# EAGLE design TMotor_Rev0_5_1_Mark_2_MAR17 (EAGLE 9.6.2)

## Sheet 1 of 5: Arduino Nano Sense and Teensy
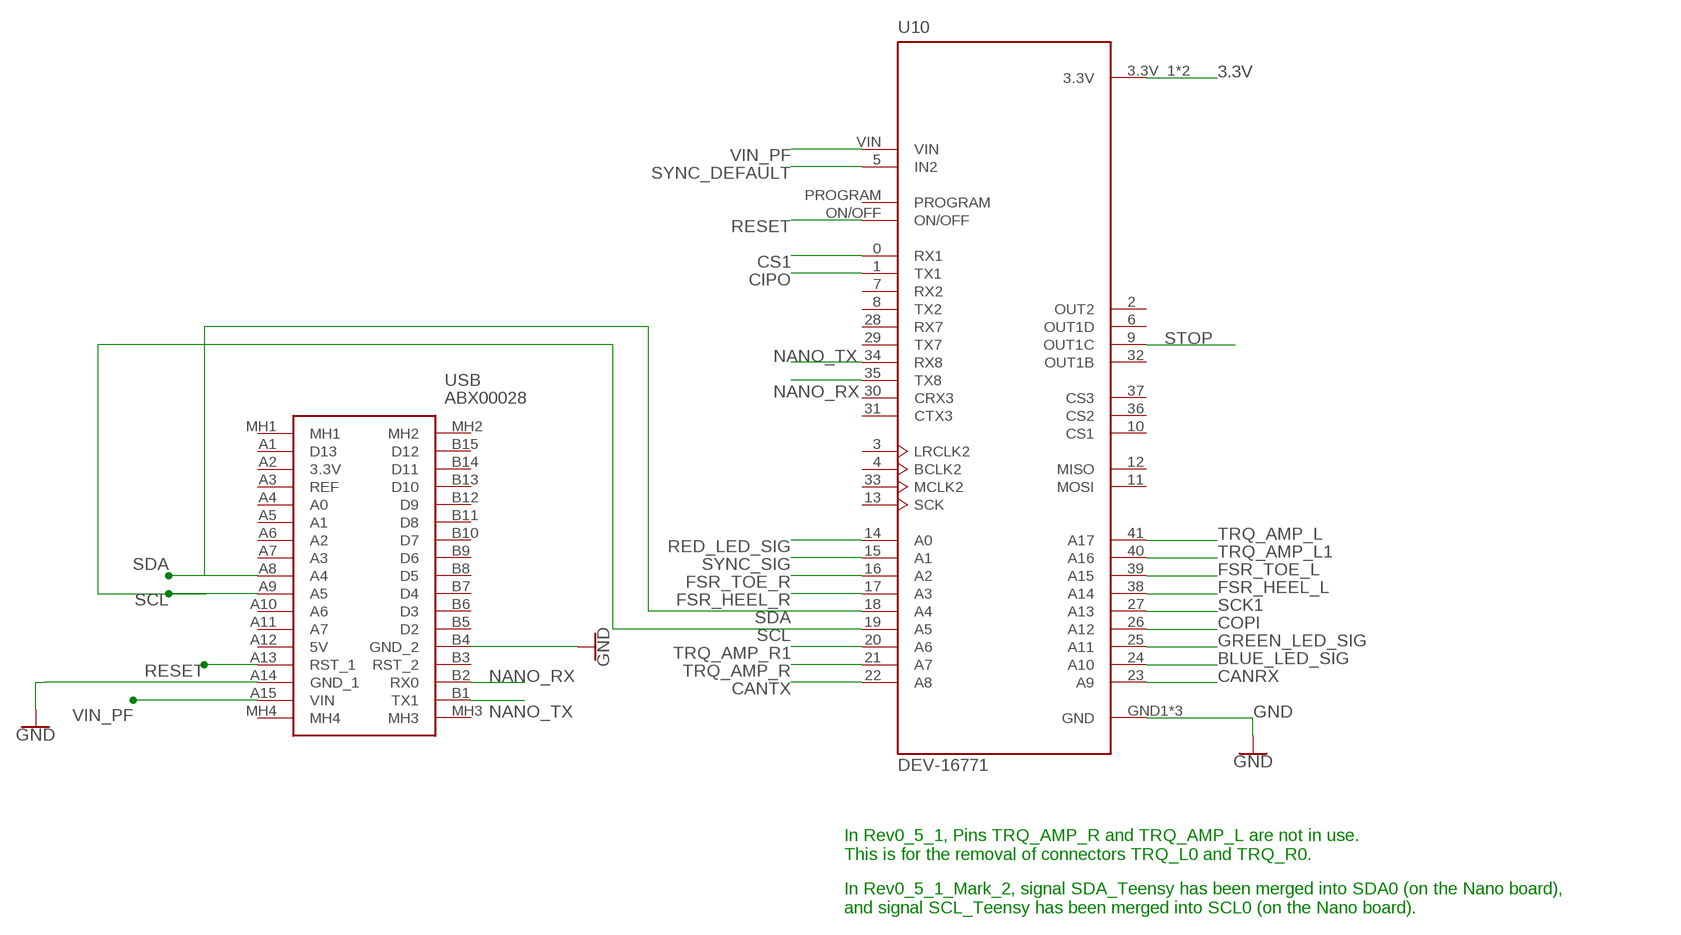
[diagram p0: schematic, sheet 1]

### Parts
U10  DEV-16771  [MODULE_DEV-16771]
USB  ABX00028  [ABX00028]

### Nets
3.3V: U10.3.3V_1(3.3V) U10.3.3V_2(3.3V) ; also sheet 2,4,5
BLUE_LED_SIG: U10.24(A10) ; also sheet 4
CANRX: U10.23(A9) ; also sheet 2
CANTX: U10.22(A8) ; also sheet 2
CIPO: U10.1(TX1) ; also sheet 2
COPI: U10.26(A12) ; also sheet 2
CS1: U10.0(RX1) ; also sheet 2
FSR_HEEL_L: U10.38(A14) ; also sheet 5
FSR_HEEL_R: U10.17(A3) ; also sheet 5
FSR_TOE_L: U10.39(A15) ; also sheet 5
FSR_TOE_R: U10.16(A2) ; also sheet 5
GND: U10.GND1(GND) U10.GND2(GND) U10.GND3(GND) USB.A14(GND_1) USB.B4(GND_2) ; also sheet 2,4,5
GREEN_LED_SIG: U10.25(A11) ; also sheet 4
NANO_RX: U10.35(TX8) USB.B2(RX0)
NANO_TX: U10.34(RX8) USB.B1(TX1)
RED_LED_SIG: U10.14(A0) ; also sheet 4
RESET: U10.ON/OFF USB.A13(RST_1) ; also sheet 2
SCK1: U10.27(A13) ; also sheet 2
SCL: U10.19(A5) USB.A9(A5) ; also sheet 2
SDA: U10.18(A4) USB.A8(A4) ; also sheet 2
STOP: U10.9(OUT1C) ; also sheet 2
SYNC_DEFAULT: U10.5(IN2) ; also sheet 2
SYNC_SIG: U10.15(A1) ; also sheet 4
TRQ_AMP_L: U10.41(A17)
TRQ_AMP_L1: U10.40(A16) ; also sheet 5
TRQ_AMP_R: U10.21(A7)
TRQ_AMP_R1: U10.20(A6) ; also sheet 5
VIN_PF: U10.VIN USB.A15(VIN) ; also sheet 2
Unconnected: U10.2(OUT2) U10.3(LRCLK2) U10.4(BCLK2) U10.6(OUT1D) U10.7(RX2) U10.8(TX2) U10.10(CS1) U10.11(MOSI) U10.12(MISO) U10.13(SCK) U10.28(RX7) U10.29(TX7) U10.30(CRX3) U10.31(CTX3) U10.32(OUT1B) U10.33(MCLK2) U10.36(CS2) U10.37(CS3) U10.PROGRAM USB.A1(D13) USB.A2(3.3V) USB.A3(REF) USB.A4(A0) USB.A5(A1) USB.A6(A2) USB.A7(A3) USB.A10(A6) USB.A11(A7) USB.A12(5V) USB.B3(RST_2) USB.B5(D2) USB.B6(D3) USB.B7(D4) USB.B8(D5) USB.B9(D6) USB.B10(D7) USB.B11(D8) USB.B12(D9) USB.B13(D10) USB.B14(D11) USB.B15(D12) USB.MH1 USB.MH2 USB.MH3 USB.MH4

### Notes on the sheet
- In Rev0_5_1, Pins TRQ_AMP_R and TRQ_AMP_L are not in use.
  This is for the removal of connectors TRQ_L0 and TRQ_R0.
- In Rev0_5_1_Mark_2, signal SDA_Teensy has been merged into SDA0 (on the Nano board),
  and signal SCL_Teensy has been merged into SCL0 (on the Nano board).

## Sheet 2 of 5: Motor Drivers & Power
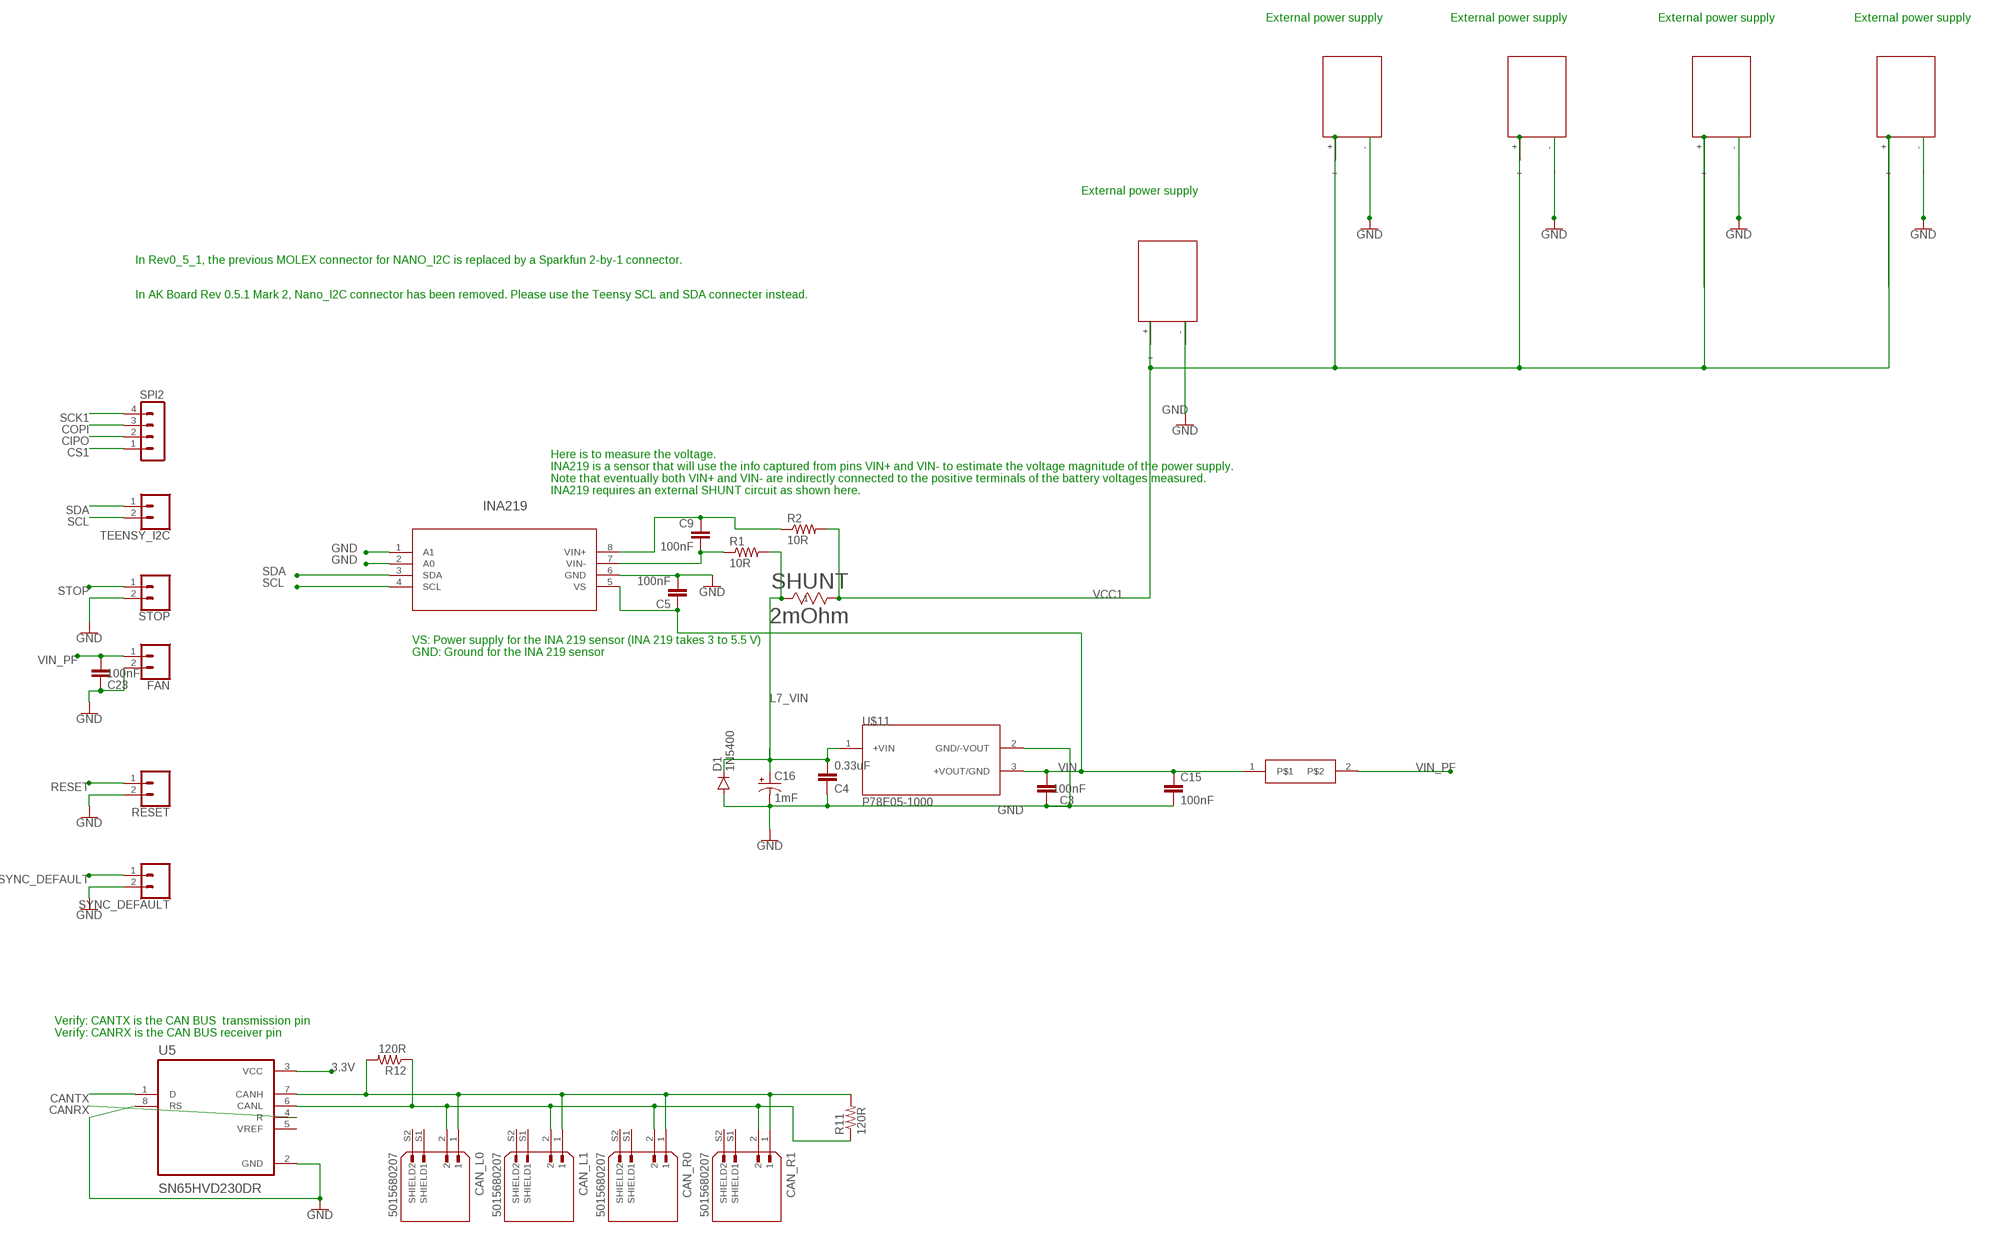
[diagram p1: schematic, sheet 2]

### Parts
C3  100nF  C-EU050-024X044  [C050-024X044]
C4  0.33uF  C-EU050-024X044  [C050-024X044]
C5  100nF  C-EU050-024X044  [C050-024X044]
C9  100nF  C-EU050-024X044  [C050-024X044]
C15  100nF  C-EU050-024X044  [C050-024X044]
C16  1mF  CPOL-USE5-10.5  [E5-10,5]
C23  100nF  C-EU050-024X044  [C050-024X044]
CAN_L0  5015680207  [MOLEX_5015680207]
CAN_L1  5015680207  [MOLEX_5015680207]
CAN_R0  5015680207  [MOLEX_5015680207]
CAN_R1  5015680207  [MOLEX_5015680207]
D1  1N5400  [DO201-15]
FAN  CONN_02  [1X02]
INA219  INA219AIDR  [D8_TEX]
R1  10R  R-US_0207/10  [0207/10]
R2  10R  R-US_0207/10  [0207/10]
R11  120R  R-US_0207/10  [0207/10]
R12  120R  R-US_0207/10  [0207/10]
RESET  CONN_02  [1X02]
SHUNT  2mOhm  CSNL2512FT2L00  [STA_CSNL2512(2)_STP]
SPI2  MA04-1  [MA04-1]
STOP  CONN_02  [1X02]
SYNC_DEFAULT  CONN_02  [1X02]
TEENSY_I2C  CONN_02  [1X02]
U5  SN65HVD230DR  [SOIC127P599X175-8N]
U$6  0458002.DR  [FUSE_LITTEL_448]
U$11  P78E05-1000  [P78E05-1000]
XT30UPB-F  L_0  XT30UPB-F  [XT30UPB-F]
XT30UPB-F1  L_0  XT30UPB-F  [XT30UPB-F]
XT30UPB-F2  L_0  XT30UPB-F  [XT30UPB-F]
XT30UPB-F3  L_0  XT30UPB-F  [XT30UPB-F]
XT30UPB-F4  L_0  XT30UPB-F  [XT30UPB-F]

### Nets
3.3V: U5.3(VCC) ; also sheet 1,4,5
CANRX: U5.4(R) ; also sheet 1
CANTX: U5.1(D) ; also sheet 1
CIPO: SPI2.2 ; also sheet 1
COPI: SPI2.3 ; also sheet 1
CS1: SPI2.1 ; also sheet 1
GND: C3.1 C4.1 C5.2 C15.2 C16.- C23.1 D1.A FAN.2 INA219.1(A1) INA219.2(A0) INA219.6(GND) RESET.2 STOP.2 SYNC_DEFAULT.2 U5.2(GND) U5.8(RS) U$11.2(GND/-VOUT) XT30UPB-F1.- XT30UPB-F2.- XT30UPB-F3.- XT30UPB-F4.- XT30UPB-F.- ; also sheet 1,4,5
L7_VIN: C4.2 C16.+ D1.C R1.2 SHUNT.1 U$11.1(+VIN)
N$23: C9.1 INA219.8(VIN+) R2.1
N$26: C9.2 INA219.7(VIN-) R1.1
N$44: CAN_L0.1 CAN_L1.1 CAN_R0.1 CAN_R1.1 R11.2 R12.2 U5.7(CANH)
N$45: CAN_L0.2 CAN_L1.2 CAN_R0.2 CAN_R1.2 R11.1 R12.1 U5.6(CANL)
RESET: RESET.1 ; also sheet 1
SCK1: SPI2.4 ; also sheet 1
SCL: INA219.4(SCL) TEENSY_I2C.2 ; also sheet 1
SDA: INA219.3(SDA) TEENSY_I2C.1 ; also sheet 1
STOP: STOP.1 ; also sheet 1
SYNC_DEFAULT: SYNC_DEFAULT.1 ; also sheet 1
VCC1: R2.2 SHUNT.2 XT30UPB-F1.+ XT30UPB-F2.+ XT30UPB-F3.+ XT30UPB-F4.+ XT30UPB-F.+
VIN: C3.2 C5.1 C15.1 INA219.5(VS) U$6.1 U$11.3(+VOUT/GND)
VIN_PF: C23.2 FAN.1 U$6.2 ; also sheet 1
Unconnected: CAN_L0.S1(SHIELD1) CAN_L0.S2(SHIELD2) CAN_L1.S1(SHIELD1) CAN_L1.S2(SHIELD2) CAN_R0.S1(SHIELD1) CAN_R0.S2(SHIELD2) CAN_R1.S1(SHIELD1) CAN_R1.S2(SHIELD2) U5.5(VREF)

### Notes on the sheet
- External power supply | External power supply | External power supply | External power supply
- External power supply
- In Rev0_5_1, the previous MOLEX connector for NANO_I2C is replaced by a Sparkfun 2-by-1 connector.
- In AK Board Rev 0.5.1 Mark 2, Nano_I2C connector has been removed. Please use the Teensy SCL and SDA connecter instead.
- Here is to measure the voltage.
  INA219 is a sensor that will use the info captured from pins VIN+ and VIN- to estimate the voltage magnitude of the power supply.
  Note that eventually both VIN+ and VIN- are indirectly connected to the positive terminals of the battery voltages measured.
  INA219 requires an external SHUNT circuit as shown here.
- VS: Power supply for the INA 219 sensor (INA 219 takes 3 to 5.5 V)
  GND: Ground for the INA 219 sensor
- Verify: CANTX is the CAN BUS  transmission pin
  Verify: CANRX is the CAN BUS receiver pin

## Sheet 3 of 5: FSRs filters
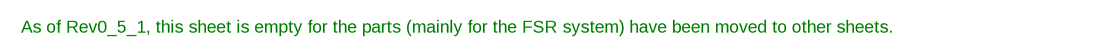
[diagram p2: schematic, sheet 3]

### Notes on the sheet
- As of Rev0_5_1, this sheet is empty for the parts (mainly for the FSR system) have been moved to other sheets.

## Sheet 4 of 5: LED
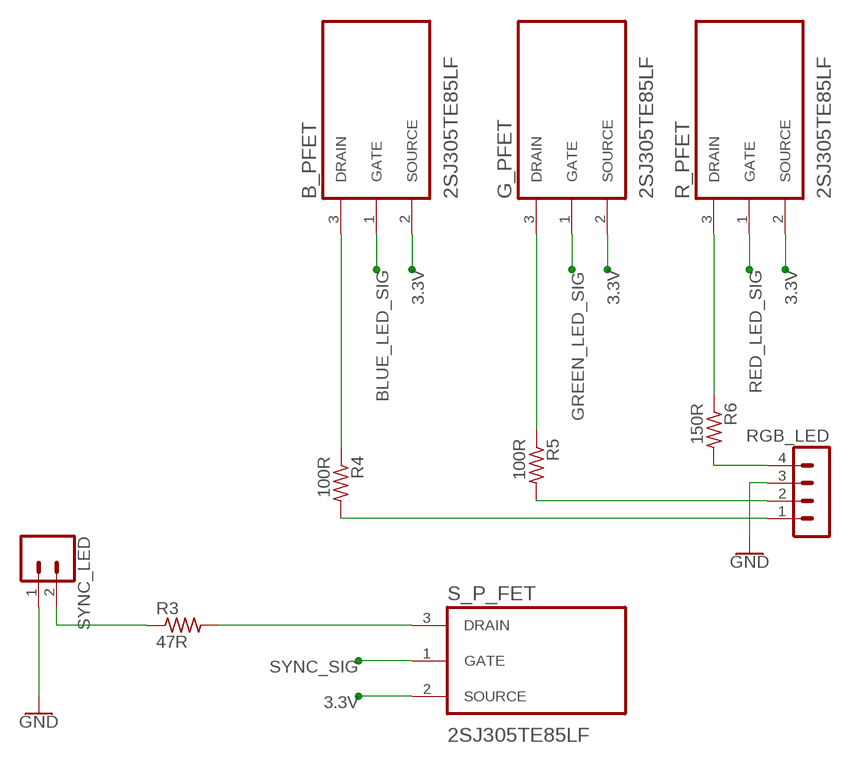
[diagram p3: schematic, sheet 4]

### Parts
B_PFET  2SJ305TE85LF  [TRANS_SSM3J325F,LF]
G_PFET  2SJ305TE85LF  [TRANS_SSM3J325F,LF]
R3  47R  R-US_0207/10  [0207/10]
R4  100R  R-US_0207/10  [0207/10]
R5  100R  R-US_0207/10  [0207/10]
R6  150R  R-US_0207/10  [0207/10]
R_PFET  2SJ305TE85LF  [TRANS_SSM3J325F,LF]
RGB_LED  MA04-1  [MA04-1]
S_P_FET  2SJ305TE85LF  [TRANS_SSM3J325F,LF]
SYNC_LED  CONN_02  [1X02]

### Nets
3.3V: B_PFET.2(SOURCE) G_PFET.2(SOURCE) R_PFET.2(SOURCE) S_P_FET.2(SOURCE) ; also sheet 1,2,5
BLUE_LED_SIG: B_PFET.1(GATE) ; also sheet 1
GND: RGB_LED.3 SYNC_LED.1 ; also sheet 1,2,5
GREEN_LED_SIG: G_PFET.1(GATE) ; also sheet 1
N$1: R4.2 RGB_LED.1
N$2: B_PFET.3(DRAIN) R4.1
N$17: R3.2 S_P_FET.3(DRAIN)
N$18: R3.1 SYNC_LED.2
N$24: R6.2 RGB_LED.4
N$25: R5.2 RGB_LED.2
N$30: G_PFET.3(DRAIN) R5.1
N$31: R6.1 R_PFET.3(DRAIN)
RED_LED_SIG: R_PFET.1(GATE) ; also sheet 1
SYNC_SIG: S_P_FET.1(GATE) ; also sheet 1

## Sheet 5 of 5: Bluetooth
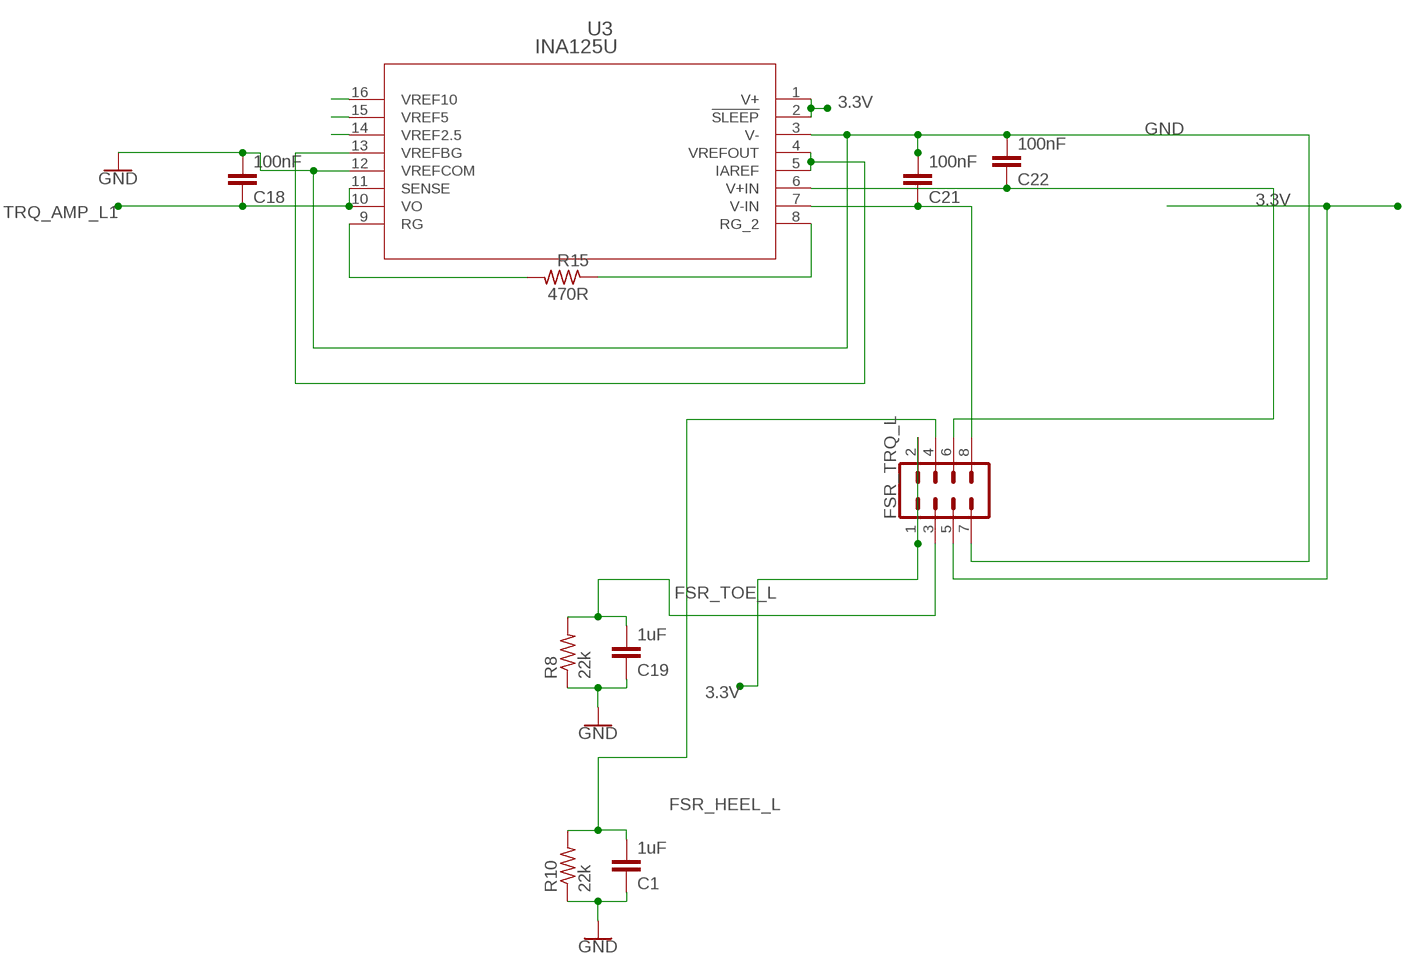
[diagram p4: schematic, sheet 5, part 1 of 2]
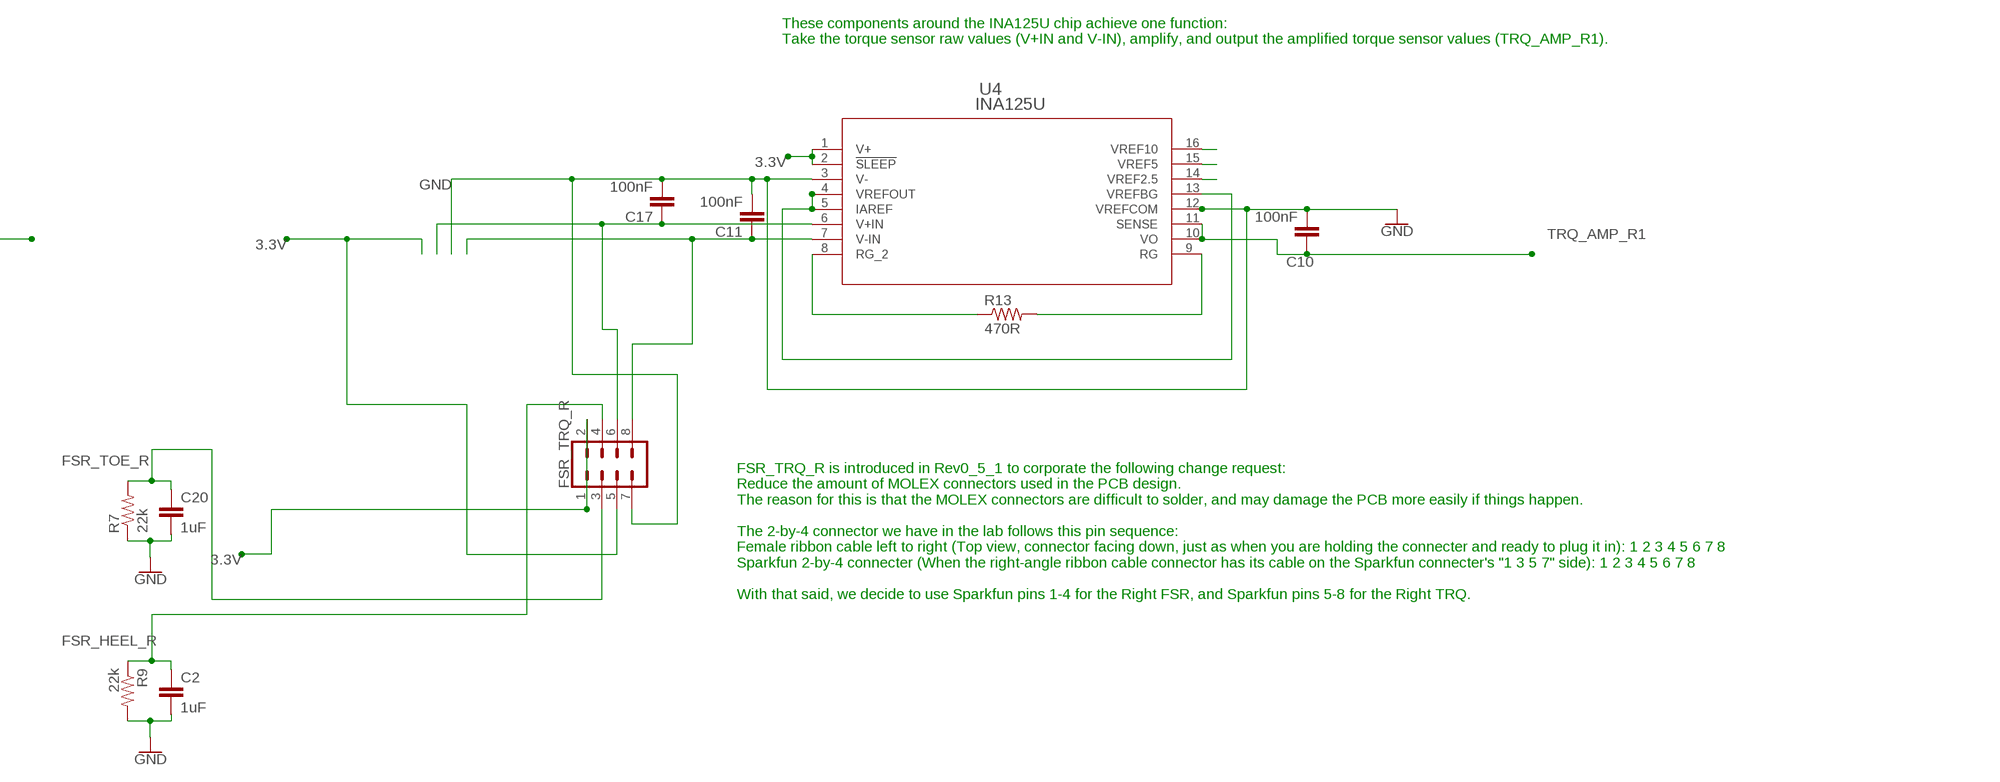
[diagram p5: schematic, sheet 5, part 2 of 2]

### Parts
C1  1uF  C-EU050-024X044  [C050-024X044]
C2  1uF  C-EU050-024X044  [C050-024X044]
C10  100nF  C-EU050-024X044  [C050-024X044]
C11  100nF  C-EU050-024X044  [C050-024X044]
C17  100nF  C-EU050-024X044  [C050-024X044]
C18  100nF  C-EU050-024X044  [C050-024X044]
C19  1uF  C-EU050-024X044  [C050-024X044]
C20  1uF  C-EU050-024X044  [C050-024X044]
C21  100nF  C-EU050-024X044  [C050-024X044]
C22  100nF  C-EU050-024X044  [C050-024X044]
FSR_TRQ_L  CONN_04X2  [2X4]
FSR_TRQ_R  CONN_04X2  [2X4]
R7  22k  R-US_0207/10  [0207/10]
R8  22k  R-US_0207/10  [0207/10]
R9  22k  R-US_0207/10  [0207/10]
R10  22k  R-US_0207/10  [0207/10]
R13  470R  R-US_0207/10  [0207/10]
R15  470R  R-US_0207/10  [0207/10]
U3  INA125U  [D16]
U4  INA125U  [D16]

### Nets
3.3V: FSR_TRQ_L.1 FSR_TRQ_L.2 FSR_TRQ_L.5 FSR_TRQ_R.1 FSR_TRQ_R.2 FSR_TRQ_R.5 U3.1(V+) U3.2(!SLEEP) U4.1(V+) U4.2(!SLEEP) ; also sheet 1,2,4
FSR_HEEL_L: C1.2 FSR_TRQ_L.4 R10.2 ; also sheet 1
FSR_HEEL_R: C2.1 FSR_TRQ_R.4 R9.1 ; also sheet 1
FSR_TOE_L: C19.2 FSR_TRQ_L.3 R8.2 ; also sheet 1
FSR_TOE_R: C20.1 FSR_TRQ_R.3 R7.2 ; also sheet 1
GND: C1.1 C2.2 C10.2 C11.2 C17.2 C18.2 C19.1 C20.2 C21.2 C22.2 FSR_TRQ_L.7 FSR_TRQ_R.7 R7.1 R8.1 R9.2 R10.1 U3.3(V-) U3.12(VREFCOM) U4.3(V-) U4.12(VREFCOM) ; also sheet 1,2,4
N$4: U4.16(VREF10)
N$14: U4.15(VREF5)
N$15: U4.4(VREFOUT) U4.5(IAREF) U4.13(VREFBG)
N$16: R13.1 U4.8(RG_2)
N$19: U4.14(VREF2.5)
N$27: R13.2 U4.9(RG)
N$28: C17.1 FSR_TRQ_R.6 U4.6(V+IN)
N$29: C11.1 FSR_TRQ_R.8 U4.7(V-IN)
N$32: U3.4(VREFOUT) U3.5(IAREF) U3.13(VREFBG)
N$33: C22.1 FSR_TRQ_L.6 U3.6(V+IN)
N$34: C21.1 FSR_TRQ_L.8 U3.7(V-IN)
N$35: R15.2 U3.9(RG)
N$36: R15.1 U3.8(RG_2)
N$40: U3.16(VREF10)
N$41: U3.15(VREF5)
N$42: U3.14(VREF2.5)
TRQ_AMP_L1: C18.1 U3.10(VO) U3.11(SENSE) ; also sheet 1
TRQ_AMP_R1: C10.1 U4.10(VO) U4.11(SENSE) ; also sheet 1

### Notes on the sheet
- These components around the INA125U chip achieve one function:
  Take the torque sensor raw values (V+IN and V-IN), amplify, and output the amplified torque sensor values (TRQ_AMP_R1).
- FSR_TRQ_R is introduced in Rev0_5_1 to corporate the following change request:
  Reduce the amount of MOLEX connectors used in the PCB design. 
  The reason for this is that the MOLEX connectors are difficult to solder, and may damage the PCB more easily if things happen.
  
  The 2-by-4 connector we have in the lab follows this pin sequence:
  Female ribbon cable left to right (Top view, connector facing down, just as when you are holding the connecter and ready to plug it in): 1 2 3 4 5 6 7 8
  Sparkfun 2-by-4 connecter (When the right-angle ribbon cable connector has its cable on the Sparkfun connecter's "1 3 5 7" side): 1 2 3 4 5 6 7 8
  
  With that said, we decide to use Sparkfun pins 1-4 for the Right FSR, and Sparkfun pins 5-8 for the Right TRQ.

## Library data of the parts
B_PFET G_PFET R_PFET S_P_FET = 2SJ305TE85LF:2SJ305TE85LF: None Check prices <https://pricing.snapeda.com/parts/2SJ305TE85LF/Toshiba/view-part?ref=eda>; AVAILABILITY: In Stock; DESCRIPTION: P-Channel 30V 200mA (Ta) 200mW (Ta) Surface Mount SC-59; MF: Toshiba; MP: 2SJ305TE85LF; PACKAGE: SC-59 Toshiba; PRICE: None; PURCHASE-URL: https://pricing.snapeda.com/search/part/2SJ305TE85LF/?ref=eda
C1-C5 C9-C11 C15 C17-C23 = rcl:C-EU: CAPACITOR, European symbol; SPICEPREFIX: C
C16 = rcl:CPOL-US: POLARIZED CAPACITOR, American symbol; SPICEPREFIX: C
CAN_L0 CAN_L1 CAN_R0 CAN_R1 = SnapEDA-Library:5015680207; MANUFACTURER: Molex; MAXIMUM_PACKAGE_HEIGHT: 3.2 mm; PARTREV: A; STANDARD: Manufacturer Recommendations
D1 = diode:1N5400: DIODE standard rectifier, 3 A, 50 V (Motorola)
FAN RESET STOP SYNC_DEFAULT SYNC_LED TEENSY_I2C = SparkFun-Connectors:CONN_02: Multi connection point. Often used as Generic Header-pin footprint for 0.1 inch spaced/style header connections On any of the 0.1 inch spaced packages, you can populate with these: Break Away Headers - Straight <https://www.sparkfun.com/products/116> (PRT-00116) Break Away Male Headers - Right Angle <https://www.sparkfun.com/products/553> (PRT-00553) Female Headers <https://www.sparkfun.com/products/115> (PRT-00115) Break Away Headers - Machine Pin <https://www.sparkfun.com/products/117> (PRT-00117) Break Away Female Headers - Swiss Machine Pin <https://www.sparkfun.com/products/743> (PRT-00743) For SCREWTERMINALS and SPRING TERMINALS visit here: Screw Terimnals on SparkFun.com <https://www.sparkfun.com/search/results?term=Screw+Terminals> (5mm/3.5mm/2.54mm spacing) This device is also useful as a general connection point to wire up your design to another part of your project. Our various solder wires solder well into these plated through hole pads. Hook-Up Wire - Assortment (Stranded, 22 AWG) <https://www.sparkfun.com/products/11375> (PRT-11375) Hook-Up Wire - Assortment (Solid Core, 22 AWG) <https://www.sparkfun.com/products/11367> (PRT-11367) View the entire wire category on our website here <https://www.sparkfun.com/categories/141> Special notes: Molex polarized connector foot print use with: PRT-08233 with associated crimp pins and housings. 2.54_SCREWTERM for use with PRT-10571. 3.5mm Screw Terminal footprints for PRT-08084 5mm Screw Terminal footprints for use with PRT-08432
FSR_TRQ_L FSR_TRQ_R = SparkFun-Connectors:CONN_04X2: Multi connection point. Often used as Generic Header-pin footprint for 0.1 inch spaced/style header connections On any of the 0.1 inch spaced packages, you can populate with these: Break Away Headers - Straight <https://www.sparkfun.com/products/116> (PRT-00116) Break Away Male Headers - Right Angle <https://www.sparkfun.com/products/553> (PRT-00553) Female Headers <https://www.sparkfun.com/products/115> (PRT-00115) Break Away Headers - Machine Pin <https://www.sparkfun.com/products/117> (PRT-00117) Break Away Female Headers - Swiss Machine Pin <https://www.sparkfun.com/products/743> (PRT-00743)
INA219 = INA219:INA219AIDR; BUILT_BY: EMA_UL_Team; MANUFACTURER_PART_NUMBER: INA219AIDR; SOURCELIBRARY: TI_2015-1-5; VENDOR: Texas Instruments
R1-R6 R11-R13 R15 = rcl:R-US_: RESISTOR, American symbol; SPICEPREFIX: R
R7-R10 = resistor:R-US_: RESISTOR, American symbol
RGB_LED SPI2 = con-lstb:MA04-1: PIN HEADER; OC_FARNELL: unknown; OC_NEWARK: unknown
SHUNT = ShuntResistor:CSNL2512FT2L00; BUILT_BY: EMA_UL_Team; MANUFACTURER_PART_NUMBER: CSNL2512FT2L00; SOURCELIBRARY: Stackpole_2014-12-31; VENDOR: Stackpole International
U3 U4 = Digikey:INA125U; DATASHEET_URL: http://www.ti.com/lit/gpn/INA125; DESCRIPTION: Instrumentation Amplifier with Precision Voltage Reference; FAMILY_NAME: SINGLE SUPPLY; GENERIC_PART_NUMBER: INA125; INDUSTRY_STD_PKG_TYPE: SOIC; MANUFACTURER: Texas Instruments; MANUFACTURER_PART_NUMBER: INA125U; PACKAGE_DESIGNATOR: D; PIN_COUNT: 16; VENDOR: Texas Instruments
U5 = SN65HVD230DR:SN65HVD230DR: Check availability <https://pricing.snapeda.com/parts/SN65HVD230DR/Texas%20Instruments/view-part?ref=eda>; AVAILABILITY: In Stock; DESCRIPTION: 3.3 V CAN Transceiver with Standby Mode; MF: Texas Instruments; MP: SN65HVD230DR; PACKAGE: SOIC-8 Texas Instruments; PRICE: None; PURCHASE-URL: https://pricing.snapeda.com/search/part/SN65HVD230DR/?ref=eda
U10 = SnapEDA-Library:DEV-16771: RT1062 Teensy 4.1 i.MX ARM Cortex-M7 MPU Embedded Evaluation Board; MANUFACTURER: SparkFun Electronics; MAXIMUM_PACKAGE_HEIGHT: 4.07mm; PARTREV: 4.1; STANDARD: Manufacturer recommendations
U$6 = SnapEDA-Library (1):0458002.DR: 0448002.MR Digi-Key Part Number - F1638TR-ND - Tape & Reel (TR) - F1638CT-ND - Cut Tape (CT) - F1638DKR-ND - Digi-Reel® Manufacturer - Littelfuse Inc. Manufacturer Product Number - 0448002.MR Description - FUSE BOARD MNT 2A 125VAC/VDC SMD
U$11 = SnapEDA-Library_Paul:P78E05-1000: Digikey 102-5018-ND Non-Isolated PoL Module DC DC Converter 1 Output 5V 1A 8V - 36V Input
USB = ABX00028:ABX00028: Development Boards & Kits - AVR Arduino Nano Every Source: Datasheet <https://store.arduino.cc/arduino-nano-every>; ARROW_PART_NUMBER: ABX00028; ARROW_PRICE-STOCK: https://www.arrow.com/en/products/abx00028/arduino-corporation; DESCRIPTION: Development Boards & Kits - AVR Arduino Nano Every; HEIGHT: 10mm; MANUFACTURER_NAME: Arduino; MANUFACTURER_PART_NUMBER: ABX00028; MOUSER_PART_NUMBER: 782-ABX00028; MOUSER_PRICE-STOCK: https://www.mouser.co.uk/ProductDetail/Arduino/ABX00028/?qs=PzGy0jfpSMtit6rnFl8mVg%3D%3D
XT30UPB-F XT30UPB-F1-XT30UPB-F4 = XT30UPB-F:XT30UPB-F: XT30 PCB Mount Upright Female Power Connector. 15A cont. 30A burst.

## Board
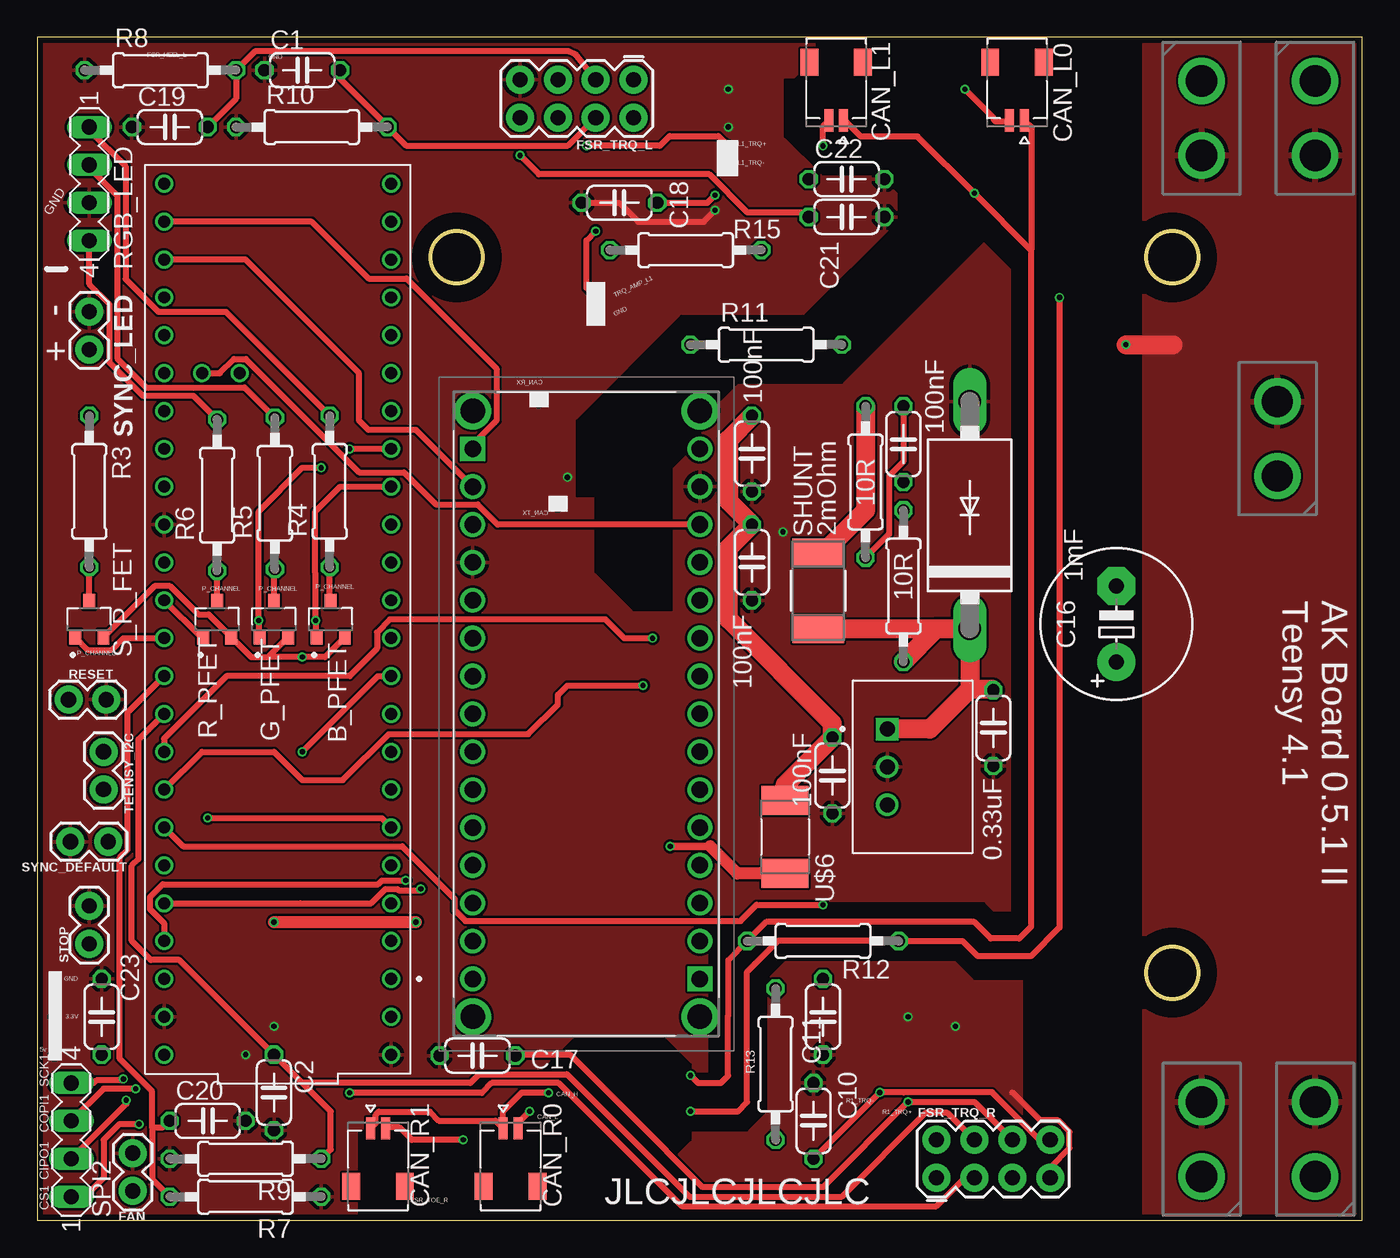
[diagram p6: board, top side]
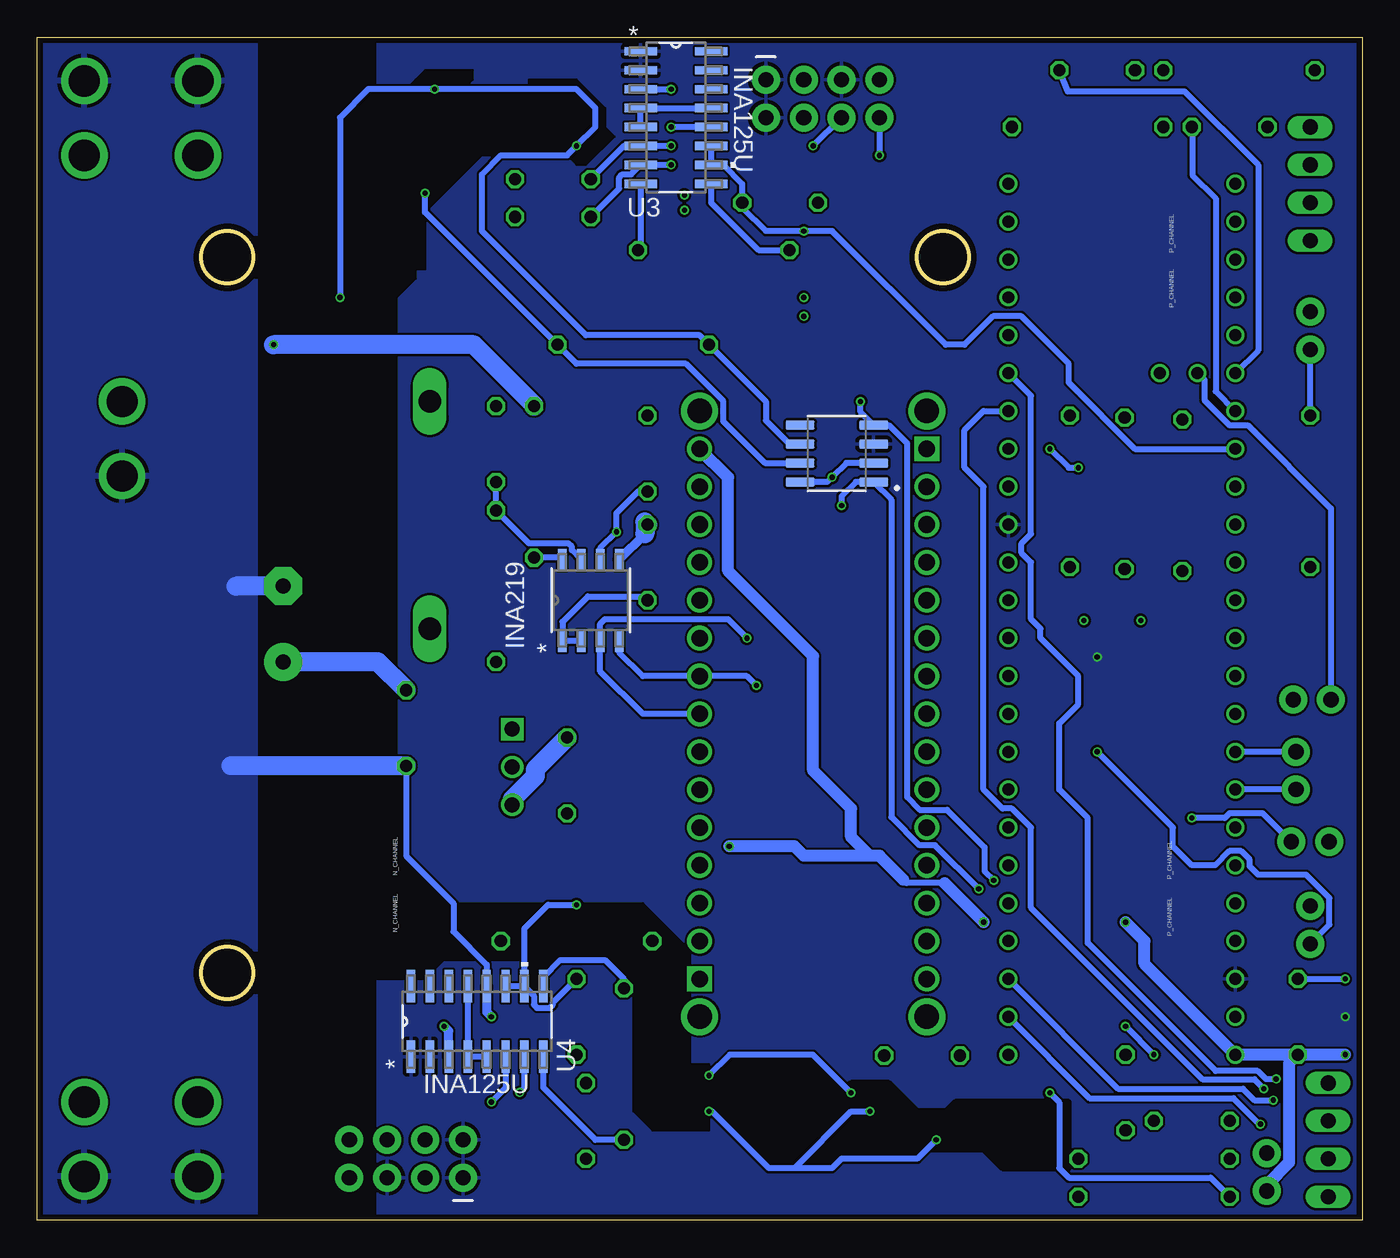
[diagram p7: board, bottom side, seen from below]

Size 88.88 x 79.36 mm. Coordinates in mm from the lower left corner, seen from the top.
Outline: 0,0 88.88,0 88.88,79.36 0,79.36 0,0
Outline: circle at 28.13,64.6 radius 1.75
Outline: circle at 76.13,64.6 radius 1.75
Outline: circle at 76.13,16.6 radius 1.75
Copper layers (1*16): Top 0.035559375mm / dielectric 1.6mm / Bottom 0.035559375mm
Design rules "oshpark-2layer": minimum track width 6mil, minimum drill 10mil, track to track 6mil, track to pad 6mil, pad to pad 6mil, via to via 6mil, smd to smd 6mil, copper to edge 15mil, drill to drill 6mil, minimum pad ring 5mil, minimum via ring 5mil, stop-mask expansion 2.5mil, vias tented up to drill 0mil, thermal gap 10mil
tRestrict: area 56.8,18.1 to 58.2,18.1; area 73.1,61.6 to 79.1,67.6; area 73.1,13.6 to 79.1,19.6; area 25.1,61.6 to 31.1,67.6; area 27.3,2.2 to 43.8,12.4; area 36.2,6 to 69.8,76.5; area 50.2,60.6 to 70.5,77.2; area 37.5,41 to 42.5,50.5
bRestrict: area 19.7,3.5 to 34.9,9.2; area 50.2,63.8 to 66,76.5; area 59.7,72.7 to 65.4,77.2; area 43.8,6 to 69.8,76.5
vRestrict: area 47,12.4 to 69.2,79.1

### Footprints (pad centres in the part's own frame; a part is rotated, then mirrored left to right if it is on the bottom)
TRANS_SSM3J325F,LF = smd 1 x 0.8: 1 -1.2,0.95; 2 -1.2,-0.95; 3 1.2,0
C050-024X044 = drill 0.813 octagon: 1 -2.54,0; 2 2.54,0
E5-10,5 = drill 1.016 pad 2.54: + -2.54,0 | drill 1.016 pad 2.54 octagon: - 2.54,0
MOLEX_5015680207 = smd 0.6 x 1.5: 1 -0.5,2.55; 2 0.5,2.55 | smd 1.2 x 1.8: S1 1.8,-1.35; S2 -1.8,-1.35
DO201-15 = drill 1.499 long: A 7.62,0; C -7.62,0
1X02 = drill 1.016 pad 1.88: 1 0,0; 2 2.54,0
2X4 = drill 1.016 pad 1.88: 1 -3.81,-1.27; 2 -3.81,1.27; 3 -1.27,-1.27; 4 -1.27,1.27; 5 1.27,-1.27; 6 1.27,1.27; 7 3.81,-1.27; 8 3.81,1.27
D8_TEX = smd 1.46 x 0.559: 1 -2.724,1.905; 2 -2.724,0.635; 3 -2.724,-0.635; 4 -2.724,-1.905; 5 2.724,-1.905; 6 2.724,-0.635; 7 2.724,0.635; 8 2.724,1.905
0207/10 = drill 0.813 octagon: 1 -5.08,0; 2 5.08,0
MA04-1 = drill 1.016 long: 1 -3.81,0; 2 -1.27,0; 3 1.27,0; 4 3.81,0
STA_CSNL2512(2)_STP = smd 1.88 x 3.429: 1 -2.565,0; 2 2.565,0
D16 = smd 2.184 x 0.559: 1 -2.362,4.445; 2 -2.362,3.175; 3 -2.362,1.905; 4 -2.362,0.635; 5 -2.362,-0.635; 6 -2.362,-1.905; 7 -2.362,-3.175; 8 -2.362,-4.445; 9 2.362,-4.445; 10 2.362,-3.175; 11 2.362,-1.905; 12 2.362,-0.635; 13 2.362,0.635; 14 2.362,1.905; 15 2.362,3.175; 16 2.362,4.445
SOIC127P599X175-8N = smd 1.97 x 0.6: 1 -2.47,1.905; 2 -2.47,0.635; 3 -2.47,-0.635; 4 -2.47,-1.905; 5 2.47,-1.905; 6 2.47,-0.635; 7 2.47,0.635; 8 2.47,1.905
MODULE_DEV-16771 = drill 0.8: 0 -26.67,-7.62; 1 -24.13,-7.62; 2 -21.59,-7.62; 3 -19.05,-7.62; 3.3V_1 6.35,-7.62; 3.3V_2 -24.13,7.62; 4 -16.51,-7.62; 5 -13.97,-7.62; 6 -11.43,-7.62; 7 -8.89,-7.62; 8 -6.35,-7.62; 9 -3.81,-7.62; 10 -1.27,-7.62; 11 1.27,-7.62; 12 3.81,-7.62; 13 3.81,7.62; 14 1.27,7.62; 15 -1.27,7.62; 16 -3.81,7.62; 17 -6.35,7.62; 18 -8.89,7.62; 19 -11.43,7.62; 20 -13.97,7.62; 21 -16.51,7.62; 22 -19.05,7.62; 23 -21.59,7.62; 24 8.89,-7.62; 25 11.43,-7.62; 26 13.97,-7.62; 27 16.51,-7.62; 28 19.05,-7.62; 29 21.59,-7.62; 30 24.13,-7.62; 31 26.67,-7.62; 32 29.21,-7.62; 33 29.21,7.62; 34 26.67,7.62; 35 24.13,7.62; 36 21.59,7.62; 37 19.05,7.62; 38 16.51,7.62; 39 13.97,7.62; 40 11.43,7.62; 41 8.89,7.62; GND1 -29.21,-7.62; GND2 6.35,7.62; GND3 -26.67,7.62; ON/OFF 16.51,5.08; PROGRAM 16.51,2.54; VIN -29.21,7.62
FUSE_LITTEL_448 = smd 1.956 x 3.15: 1 -2.451,0; 2 2.451,0
P78E05-1000 = drill 1 square: 1 -2.54,-2.54 | drill 1: 2 0,-2.54; 3 2.54,-2.54
ABX00028 = drill 1.11 pad 1.665 square: A1 0,0; B1 35.56,15.24 | drill 1.11 pad 1.665: A2 2.54,0; A3 5.08,0; A4 7.62,0; A5 10.16,0; A6 12.7,0; A7 15.24,0; A8 17.78,0; A9 20.32,0; A10 22.86,0; A11 25.4,0; A12 27.94,0; A13 30.48,0; A14 33.02,0; A15 35.56,0; B2 33.02,15.24; B3 30.48,15.24; B4 27.94,15.24; B5 25.4,15.24; B6 22.86,15.24; B7 20.32,15.24; B8 17.78,15.24; B9 15.24,15.24; B10 12.7,15.24; B11 10.16,15.24; B12 7.62,15.24; B13 5.08,15.24; B14 2.54,15.24; B15 0,15.24 | drill 1.65 pad 2.475: MH1 -2.54,0; MH2 -2.54,15.24; MH3 38.1,15.24; MH4 38.1,0
XT30UPB-F = drill 2.1: + 0,0; - 5,0

### Placement (x,y rotation side)
B_PFET  19.69,40.33 90 top
C1  17.78,77.16 0 top
C2  15.88,8.58 270 top
C3  47.94,44.14 90 top
C4  64.14,33.02 90 top
C5  53.34,29.85 270 top
C9  58.1,52.07 270 top
C10  52.7,13.65 270 top
C11  52.07,6.67 90 top
C15  47.94,51.44 270 top
C16  72.39,40.01 90 top
C17  29.53,11.05 180 top
C18  39.05,68.27 180 top
C19  8.89,73.34 0 top
C20  11.43,6.67 0 top
C21  54.29,67.31 0 top
C22  54.29,69.85 0 top
C23  4.32,13.65 270 top
CAN_L0  65.72,76.33 180 top
CAN_L1  53.59,76.33 180 top
CAN_R0  31.75,3.63 0 top
CAN_R1  22.86,3.63 0 top
D1  62.55,47.31 90 top
FAN  6.41,1.97 90 top
FSR_TRQ_L  36.2,75.25 180 top
FSR_TRQ_R  64.14,4.13 0 top
G_PFET  15.88,40.33 90 top
INA219  51.75,41.59 90 bottom
R1  58.1,42.55 270 top
R2  55.56,49.53 90 top
R3  3.49,48.9 270 top
R4  19.62,48.9 90 top
R5  15.94,48.77 90 top
R6  12.07,48.64 90 top
R7  13.97,1.59 180 top
R8  8.26,77.16 0 top
R9  13.97,4.13 180 top
R10  18.41,73.34 0 top
R11  48.9,58.74 0 top
R12  52.7,18.73 180 top
R13  49.53,10.48 90 top
R15  43.5,65.09 180 top
R_PFET  12.07,40.33 90 top
RESET  2.1,34.93 0 top
RGB_LED  3.49,69.53 270 top
S_P_FET  3.49,40.33 90 top
SHUNT  52.39,42.23 90 top
SPI2  2.29,5.4 90 top
STOP  3.49,18.54 90 top
SYNC_DEFAULT  4.76,25.4 180 top
SYNC_LED  3.49,60.96 270 top
TEENSY_I2C  4.45,31.44 270 top
U3  46.04,73.98 0 bottom
U4  59.37,13.34 90 bottom
U5  35.24,51.44 180 bottom
U10  16.13,40.33 90 top
U$6  50.17,25.72 270 top
U$11  59.56,30.42 270 top
USB  44.45,16.2 90 top
XT30UPB-F  78.11,71.44 90 top
XT30UPB-F1  85.72,71.44 90 top
XT30UPB-F2  78.11,7.94 270 top
XT30UPB-F3  85.72,7.94 270 top
XT30UPB-F4  83.19,54.93 270 top

### Tracks (layer width: path | path; a pad name or v marks a point on that pad's centre or on a via)
3.3V  (via drill 0.35)
  Top 0.406: S_P_FET.2 7.87,42.55 8.91,42.55 10.81,40.64 11.5,40.64 R_PFET.2 14.36,37.79 15.48,37.79 | 15.48,37.79 G_PFET.2 | B_PFET.2 19.3,37.79 v17.78,37.79 15.48,37.79
  other vias: 1.14,13.65
  pour Bottom: -1.27,80.65 66.04,80.65 66.04,-1.65 -1.27,-1.65
BLUE_LED_SIG  (via drill 0.35)
  Top 0.406: B_PFET.1 18.67,39.19 v18.67,40.24 18.67,43.41 18.66,43.42 18.66,47.55 20.32,49.22 U10.24
CANRX  (via drill 0.35)
  Top 0.406: U10.23 8.51,19.92 7.55,20.88 7.55,21.67 8.43,22.55 22.88,22.55 23.12,22.79 24.71,22.79 v24.72,22.8
  Bottom 0.406: v24.72,22.8 25.34,23.42 25.34,25.02 27.86,27.54 29.69,27.54 30.53,28.38 30.53,52.12 31.75,53.34 U5.4 33.66,54.23 v33.66,54.93
CANTX  (via drill 0.35)
  Top 0.406: U10.22 17.65,21.27 22.4,21.27 23.35,22.23 24.15,22.23 24.23,22.14 25.63,22.14 v25.73,22.24
  Bottom 0.406: v25.73,22.24 28.66,25.17 29.7,25.17 31.59,27.06 31.59,48.35 U5.1 33.97,49.53 34.93,48.58 v34.93,47.95
CIPO  (via drill 0.35)
  Top 0.406: v5.97,8.07 5.97,7.81 SPI2.2
  Bottom 0.406: U10.1 16.38,8.83 8,8.83 7.24,8.07 v5.97,8.07
COPI  (via drill 0.35)
  Top 0.406: v6.6,8.83 4.44,8.83 SPI2.3
  Bottom 0.406: v6.6,8.83 7.24,9.46 10.72,9.46 22.23,20.97 22.23,26.35 23.5,27.62 24.13,27.62 25.4,28.9 25.4,49.22 26.67,50.48 26.67,53.02 25.4,54.3 U10.26
CS1  (via drill 0.35)
  Top 0.406: v6.82,6.45 5.5,6.45 4.45,5.4 4.45,2.86 3.18,1.59 SPI2.1
  Bottom 0.406: v6.82,6.45 6.86,6.42 8.64,8.19 18.29,8.19 U10.0
FSR_HEEL_L
  Top 0.152: 20.16,76.74 C1.2
  Top 0.406: 20.16,76.74 23.16,73.74 R10.2 24.73,72.1 35.59,72.1 FSR_TRQ_L.4
  Bottom 0.406: U10.38 6.98,58.36 6.98,70.8 11.92,75.74 19.76,75.74 C1.2
FSR_HEEL_R
  Top 0.406: U10.17 6.8,32.26 6.8,24.24 6.35,23.8 6.35,18.73 7.62,17.47 9.53,17.47 C2.1 17.78,9.21 | FSR_TRQ_R.4 61.06,7.2 59.59,7.2 53.98,1.59 43.74,1.59 35.52,9.81 35.48,9.77 29.61,9.77 29.05,9.21 17.78,9.21 | R9.1 19.69,4.77 19.69,7.3 17.78,9.21
FSR_TOE_L
  Top 0.406: FSR_TRQ_L.3 36.1,78.22 35.66,78.42 14.61,78.42 R8.2 13.34,75.25 C19.2
  Bottom 0.152: C19.2 11.39,73.3
  Bottom 0.406: U10.39 9.83,55.62 9.83,68.57 11.39,70.12 11.39,73.3
FSR_TOE_R  (via drill 0.35)
  Top 0.406: U10.16 6.06,34.06 6.06,24.87 5.54,24.34 5.54,10.82 7.71,8.65 7.71,6.24 | 7.71,6.24 7.71,2.77 R7.2 | 7.71,6.24 8.4,6.24 C20.1 | FSR_TRQ_R.3 62.23,2.86 60.33,0.96 43.24,0.96 34.98,9.21 30.48,9.21 29.82,8.55 v20.96,8.55
  Bottom 0.406: R7.2 10.16,2.86 19.69,2.86 20.32,3.5 20.32,7.92 v20.96,8.55
GND  (via drill 0.35)
  Top 0.406: C18.2 39.05,68.27 40.32,66.99 44.7,66.99 v45.47,67.76 | FSR_TRQ_R.7 67.94,3.57 69.24,4.86 69.24,5.94 68.48,6.7 67.28,6.7 65.41,8.58
  Bottom 0.406: INA219.2 INA219.1 53.66,40.14 51.94,41.86 48.21,41.86 C3.1 | INA219.6 51.12,45.1 v50.03,46.19 50.03,47.45 48.58,48.9 C15.2 | C23.1 v1.14,16.2 | C4.1 64.14,24.45 60.96,21.27 60.96,19.37 58.74,17.15 U4.12 | U5.2 34.61,50.8 v35.56,49.85 35.88,49.53 U5.8 | U3.12 v46.36,73.34 | U3.3 v46.36,75.88 | v13.97,11.12 15.85,13 15.85,13.02
  Bottom 0.61: U4.12 58.74,13.97 v58.42,13.65 | U4.3 61.28,12.7 v61.59,13.02
  Bottom 1.27: C16.- 75.56,42.55 | C4.1 75.88,30.48
  other vias: 37.47,60.65 15.88,13.02
  pour Top: -0.7,80.01 66.04,80.01 66.04,-1.01 -0.7,-1.01
  pour Bottom: 74.3,79.69 74.3,-0.95 90.81,-0.95 90.81,79.69
GREEN_LED_SIG  (via drill 0.35)
  Top 0.406: G_PFET.1 14.86,39.19 v14.86,40.24 14.86,47.56 17.78,50.48 v19.05,50.48 | U10.25 v20.96,51.76
  Bottom 0.406: v20.96,51.76 19.69,50.48 v19.05,50.48
L7_VIN
  Top 1.27: D1.C 62.52,39.66 SHUNT.1 | 62.55,35.64 64.06,35.64 C4.2 | D1.C 62.55,35.64 | 62.55,35.64 59.87,32.96 U$11.1 | R1.2 60.33,39.69 D1.C
  Bottom 1.27: C4.2 66.04,37.47 C16.+
N$1
  Top 0.406: RGB_LED.1 3.49,73.15 5.93,70.71 5.93,63.14 8.11,60.96 12.64,60.96 R4.2
N$2
  Top 0.406: B_PFET.3 19.62,41.59 R4.1
N$15
  Bottom 0.406: U4.5 U4.4 U4.13
N$16
  Bottom 0.406: R13.1 51.44,5.4 54.93,8.89 U4.8
N$17
  Top 0.406: S_P_FET.3 R3.2
N$18
  Bottom 0.406: R3.1 3.49,58.37 SYNC_LED.2
N$23
  Top 0.406: C9.1 58.1,50.9 57.14,49.93 57.14,46.03 R2.1
  Bottom 0.406: INA219.8 53.79,44.45 R2.1
N$24
  Top 0.406: RGB_LED.4 3.49,62.81 4.81,61.49 4.81,57.58 7.07,55.32 10.47,55.32 R6.2
N$25
  Top 0.406: RGB_LED.2 3.49,70.61 5.37,68.73 5.37,57.81 7.31,55.88 13.91,55.88 R5.2
N$26
  Bottom 0.406: C9.2 R1.1 55.89,45.42 53.24,45.42 53.02,45.2 53.02,44.95 INA219.7
N$27
  Bottom 0.406: U4.9 54.93,16.34 53.8,17.47 50.8,17.47 49.53,16.2 R13.2
N$28  (via drill 0.35)
  Top 0.406: C17.1 32.1,11.09 35.77,11.09 39.78,7.08 44.64,2.23 52.7,2.23 v58.42,7.94 62.87,7.94 FSR_TRQ_R.6
  Bottom 0.406: U4.6 57.47,8.89 v58.42,7.94
N$29  (via drill 0.35)
  Top 0.406: FSR_TRQ_R.8 67.24,5.4 64.04,8.6 58.15,8.6 58.12,8.58 v56.52,8.58 C11.1
  Bottom 0.406: v56.52,8.58 56.2,8.89 U4.7
N$30
  Top 0.406: G_PFET.3 15.88,43.63 R5.1
N$31
  Top 0.406: R_PFET.3 R6.1
N$32
  Bottom 0.406: U3.5 U3.4 48.4,74.59 44.18,74.59 44.16,74.61 U3.13
N$33  (via drill 0.35)
  Top 0.406: v36.83,72.07 41.76,72.07 42.42,72.74 45.69,72.74 v46.36,72.07
  Bottom 0.406: v36.83,72.07 FSR_TRQ_L.6 | C22.1 49.53,72.07 U3.6 v46.36,72.07
N$34  (via drill 0.35)
  Top 0.406: v32.38,71.44 33.66,70.17 45.09,70.17 47.62,67.63 51.44,67.63 C21.1
  Bottom 0.406: FSR_TRQ_L.8 v32.38,71.44 | C21.1 49.85,69.22 49.85,69.96 49.64,70.17 49.04,70.17 U3.7 v46.36,70.8
N$35
  Bottom 0.406: U3.9 43.67,68.27 40.5,65.09 R15.2
N$36
  Bottom 0.406: U3.8 48.4,65.27 R15.1
N$44  (via drill 0.35)
  Top 0.406: v43.81,9.72 44.32,9.21 45.86,9.21 46.34,9.7 46.34,13.74 46.36,13.75 46.36,17.47 R12.2 48.9,20.01 62.87,20.01 63.97,18.91 65.87,18.91 66.67,19.7 66.67,65.1 | CAN_R1.1 22.7,6.52 22.7,7.07 22.91,7.28 26.35,7.28 26.94,6.69 30.73,6.69 CAN_R0.1 31.25,7.3 32.52,8.58 34.29,8.58 v34.29,8.55 | 54,73.68 CAN_L1.1 54.17,73.78 55.25,72.71 59.05,72.71 v62.87,68.9 66.67,65.1 | CAN_L0.1 66.68,73.33 66.68,65.11 66.67,65.1
  Bottom 0.406: v43.81,9.72 42.42,11.12 36.85,11.12 v34.29,8.55 | U5.7 40.07,50.8 42.86,53.59 42.86,54.96 45.37,57.47 52.7,57.47 R11.2 62.87,67.63 v62.87,68.9
N$45  (via drill 0.35)
  Top 0.406: v43.81,7.3 46.99,7.3 47.62,7.94 47.62,16.68 49.68,18.73 R12.1 62.08,18.73 63.1,17.71 66.64,17.71 68.58,19.65 v68.58,61.91 | v33.02,7.3 32.25,6.54 CAN_R0.2 | CAN_L0.2 65.06,73.78 65,73.72 64.29,73.72 64.16,73.84 64.16,73.95 v62.23,75.88 | CAN_R1.2 23.52,6.18 23.58,6.23 24.3,6.23 25.13,5.4 v28.58,5.4 | v52.7,72.07 52.7,73.39 CAN_L1.2
  Bottom 0.406: 38.1,3.5 35.56,3.5 34.93,4.13 29.85,4.13 v28.58,5.4 | 38.1,3.5 39.8,3.5 43.61,7.3 v43.81,7.3 | 37.78,52 U5.6 38.42,52.07 40.01,53.66 40.01,54.93 R11.1 44.45,59.38 52.07,59.38 59.05,66.36 59.05,70.17 57.78,71.44 53.34,71.44 v52.7,72.07 51.44,73.34 51.44,74.61 52.7,75.88 v62.23,75.88 66.68,75.88 68.58,73.98 v68.58,61.91 | 38.1,3.5 34.29,7.3 v33.02,7.3
NANO_RX
  Top 0.406: USB.B2 25.4,53.02 22.23,53.02 21.59,53.66 21.59,56.84 13.97,64.45 U10.35
NANO_TX
  Top 0.406: U10.34 18.41,66.99 22.23,63.18 24.77,63.18 30.8,57.15 30.8,53.64 29.21,52.04 USB.B1
RED_LED_SIG
  Top 0.406: U10.14 10.98,39.12 R_PFET.1
RESET
  Top 0.406: USB.A13 30.89,46.68 29.54,48.03 26.74,48.03 24.6,50.17 21.61,50.17 13.98,57.79 13.19,57.79 12.24,56.84 U10.ON/OFF
  Bottom 0.406: RESET.1 2.1,47.75 7.68,53.34 8.91,53.34 10.59,55.03 10.59,56.38 U10.ON/OFF
SCK1  (via drill 0.35)
  Top 0.406: v5.78,9.48 5.68,9.38 3.96,9.38 3.78,9.21 SPI2.4
  Bottom 0.406: v5.78,9.48 6.47,9.48 7.01,10.02 9.83,10.02 18.41,18.61 18.41,26.99 20.32,28.9 20.32,33.34 19.05,34.61 19.05,36.52 21.59,39.05 21.59,39.69 22.23,40.33 22.23,44.14 22.86,44.77 22.86,45.41 22.23,46.04 22.23,55.31 U10.27
SCL  (via drill 0.35)
  Top 0.406: U10.19 11.05,31.44 15.88,31.44 17.78,29.53 20.49,29.53 23.59,32.62 32.94,32.62 34.93,34.61 34.93,35.25 35.56,35.88 v40.64,35.88
  Bottom 0.406: INA219.4 49.85,38.1 48.26,36.52 USB.A9 41.27,36.52 v40.64,35.88 | TEENSY_I2C.2 U10.19
SDA  (via drill 0.35)
  Top 0.406: U10.18 8.51,32.32 12.7,36.52 20.96,36.52 22.79,38.35 22.79,39.45 23.67,40.33 38.1,40.33 39.37,39.05 v41.27,39.05
  Bottom 0.406: USB.A8 48.26,33.98 51.12,36.83 INA219.3 51.12,40.01 50.8,40.33 42.55,40.33 v41.27,39.05 | TEENSY_I2C.1 U10.18
STOP  (via drill 0.35)
  Top 0.406: U10.9 22.86,36.52 v17.78,31.44
  Bottom 0.406: STOP.1 2.2,19.84 2.2,21.62 3.76,23.18 6.98,23.18 7.55,23.75 7.55,24.21 8.11,24.77 8.91,24.77 9.86,23.81 11.43,23.81 12.7,25.09 12.7,26.35 v17.78,31.44
SYNC_DEFAULT  (via drill 0.35)
  Top 0.406: v11.43,26.99 23.11,26.99 U10.5
  Bottom 0.406: v11.43,26.99 9.23,26.99 8.91,27.31 6.67,27.31 SYNC_DEFAULT.1
SYNC_SIG
  Top 0.406: U10.15 5.78,39.05 4.99,38.27 3.4,38.27 S_P_FET.1
TRQ_AMP_L1  (via drill 0.35)
  Top 0.406: C18.1 44.96,68.27 v45.47,68.77 | v37.47,61.91 36.83,62.55 36.83,65.72 v37.47,66.36
  Bottom 0.406: U3.11 U3.10 42.86,70.8 41.59,69.53 C18.1 41.59,67.95 40.01,66.36 v37.47,66.36 35.56,66.36 27.94,58.74 26.67,58.74 24.77,60.65 22.86,60.65 19.69,57.47 19.69,56.2 15.24,51.76 U10.40
TRQ_AMP_R1  (via drill 0.35)
  Top 0.406: v52.7,21.17 48.26,21.17 47.18,20.09 28.72,20.09 28.02,20.78 28.02,21.55 24.48,25.09 9.78,25.09 U10.20
  Bottom 0.406: U4.10 U4.11 | U4.10 56.2,19.58 54.61,21.17 v52.7,21.17 | C10.1 54.29,14.61 54.29,14.46 54.5,14.25 55.35,14.25 55.56,14.46 55.56,15.06 U4.10
VCC1  (via drill 0.35)
  Top 0.406: SHUNT.2 52.68,44.8 52.7,44.77
  Top 1.27: 52.7,44.77 55.56,47.63 R2.2 | v73.03,58.74 76.2,58.74
  Bottom 1.27: R2.2 55.56,54.71 59.6,58.74 v73.03,58.74
  pour Top: 74.3,79.69 74.3,-0.31 90.17,-0.31 90.17,79.69
VIN
  Top 1.27: C15.1 46.36,52.39 46.36,48.26 C3.2 46.36,45.09 46.36,40.33 53.34,33.34 C5.1 50.17,29.21 U$6.1
  Bottom 0.61: 48.13,46.04 INA219.5
  Bottom 1.27: C3.2 48.13,46.86 48.13,46.04 | C5.1 55.49,30.24 55.49,29.78 57.02,28.25 U$11.3
VIN_PF  (via drill 0.35)
  Top 0.508: 45.09,25.09 v42.45,25.09
  Top 0.61: 45.15,25.09 45.09,25.09
  Top 0.813: U$6.2 46.96,23.27 45.15,25.09 | v15.88,20.01 v25.4,20.01
  Bottom 0.4: 30.8,22.86 30.57,22.63 28.03,22.63
  Bottom 0.813: USB.A15 42.55,49.85 42.55,43.56 36.83,37.85 36.83,30.16 34.29,27.62 34.29,25.72 33.02,24.45 | C23.2 U10.VIN 14.61,17.21 14.61,18.73 v15.88,20.01 | FAN.1 6.41,2.39 4.92,3.89 4.92,10.52 C23.2 | v1.14,11.12 C23.2 | v42.45,25.09 38.1,25.09 37.47,24.45 33.02,24.45 | 30.8,22.86 32.38,24.45 33.02,24.45 | v25.4,20.01 28.03,22.63

### Text on the board
tPlace: AK Board 0.5.1 II / Teensy 4.1
tDocu: Updates to make: | 1. Test with multiple motors running to make sure the sensors still work. | 2. Pull up on reset | 3. Remove SPI, replace with Serial and I2C between boards | 5. Heatsink/vias on power componenets.
_tsilk: FSR_HEEL_L | GND | L1_TRQ+ | L1_TRQ- | GND | TRQ_AMP_L1 | - | GND | + | CAN_RX | CAN_TX | P_CHANNEL | P_CHANNEL | P_CHANNEL | P_CHANNEL | GND | 3.3V | 5v | SCK1 | CAN_H | R1_TRQ- | CAN_L | R1_TRQ+ | COPI1 | JLCJLCJLCJLC | CIPO1 | FSR_TOE_R | CS1
_bsilk: P_CHANNEL | P_CHANNEL | P_CHANNEL | N_CHANNEL | N_CHANNEL | P_CHANNEL